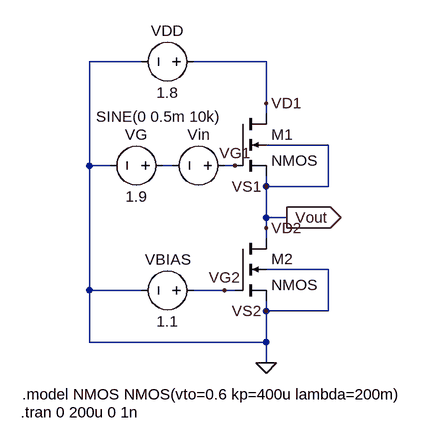
[diagram p0: schematic HW3 2-a.asc]
HW3 2-a.asc, the LTspice schematic file:
Version 4
SHEET 1 880 680
WIRE 32 -112 -48 -112
WIRE 224 -112 112 -112
WIRE 224 -48 224 -112
WIRE 224 -32 224 -48
WIRE 320 16 224 16
WIRE -48 48 -48 -112
WIRE -16 48 -48 48
WIRE 80 48 64 48
WIRE 176 48 160 48
WIRE 224 80 224 64
WIRE 320 80 320 16
WIRE 320 80 224 80
WIRE 224 128 224 80
WIRE 256 128 224 128
WIRE 224 144 224 128
WIRE 224 160 224 144
WIRE 320 208 224 208
WIRE -48 240 -48 48
WIRE 32 240 -48 240
WIRE 160 240 112 240
WIRE 176 240 160 240
WIRE 224 272 224 256
WIRE 320 272 320 208
WIRE 320 272 224 272
WIRE -48 320 -48 240
WIRE 224 320 224 272
WIRE 224 320 -48 320
WIRE 224 352 224 320
FLAG 224 352 0
FLAG 224 -48 VD1
FLAG 224 80 VS1
FLAG 224 272 VS2
FLAG 176 48 VG1
FLAG 160 240 VG2
FLAG 256 128 Vout
IOPIN 256 128 Out
FLAG 224 144 VD2
SYMBOL nmos4 176 160 R0
SYMATTR InstName M2
SYMATTR Value2 l=0.18u w=0.25u
SYMBOL nmos4 176 -32 R0
SYMATTR InstName M1
SYMATTR Value2 l=0.18u w=0.25u
SYMBOL voltage 128 240 R90
WINDOW 0 -32 56 VBottom 2
WINDOW 3 32 56 VTop 2
SYMATTR InstName VBIAS
SYMATTR Value 1.1
SYMBOL voltage 176 48 R90
WINDOW 0 -32 56 VBottom 2
WINDOW 3 -91 118 VTop 2
WINDOW 123 0 0 Left 0
WINDOW 39 0 0 Left 0
SYMATTR InstName Vin
SYMATTR Value SINE(0 0.5m 10k)
SYMBOL voltage 80 48 R90
WINDOW 0 -32 56 VBottom 2
WINDOW 3 32 56 VTop 2
SYMATTR InstName VG
SYMATTR Value 1.9
SYMBOL voltage 128 -112 R90
WINDOW 0 -32 56 VBottom 2
WINDOW 3 32 56 VTop 2
SYMATTR InstName VDD
SYMATTR Value 1.8
TEXT -152 400 Left 2 !.model NMOS NMOS(vto=0.6 kp=400u lambda=200m)
TEXT -154 428 Left 2 !.tran 0 200u 0 1n

The netlist it stands for:
* HW3 2-a.asc
M2 VD2 VG2 0 0 NMOS l=0.18u w=0.25u
M1 VD1 VG1 VD2 VD2 NMOS l=0.18u w=0.25u
VBIAS VG2 0 1.1
Vin VG1 N001 SINE(0 0.5m 10k)
VG N001 0 1.9
VDD VD1 0 1.8
.model NMOS NMOS
.model PMOS PMOS
.lib standard.mos
.model NMOS NMOS(vto=0.6 kp=400u lambda=200m)
.tran 0 200u 0 1n
.backanno
.end